# EAGLE schematic testeando_libs (EAGLE 7.2.0)
Pruebas biblioteca "treser_lib".
CDESIGNER: Treser; CNAME: PRUEBAS BIBLIOTECA; CREVISION: 1; CSCHO: EEST N°5
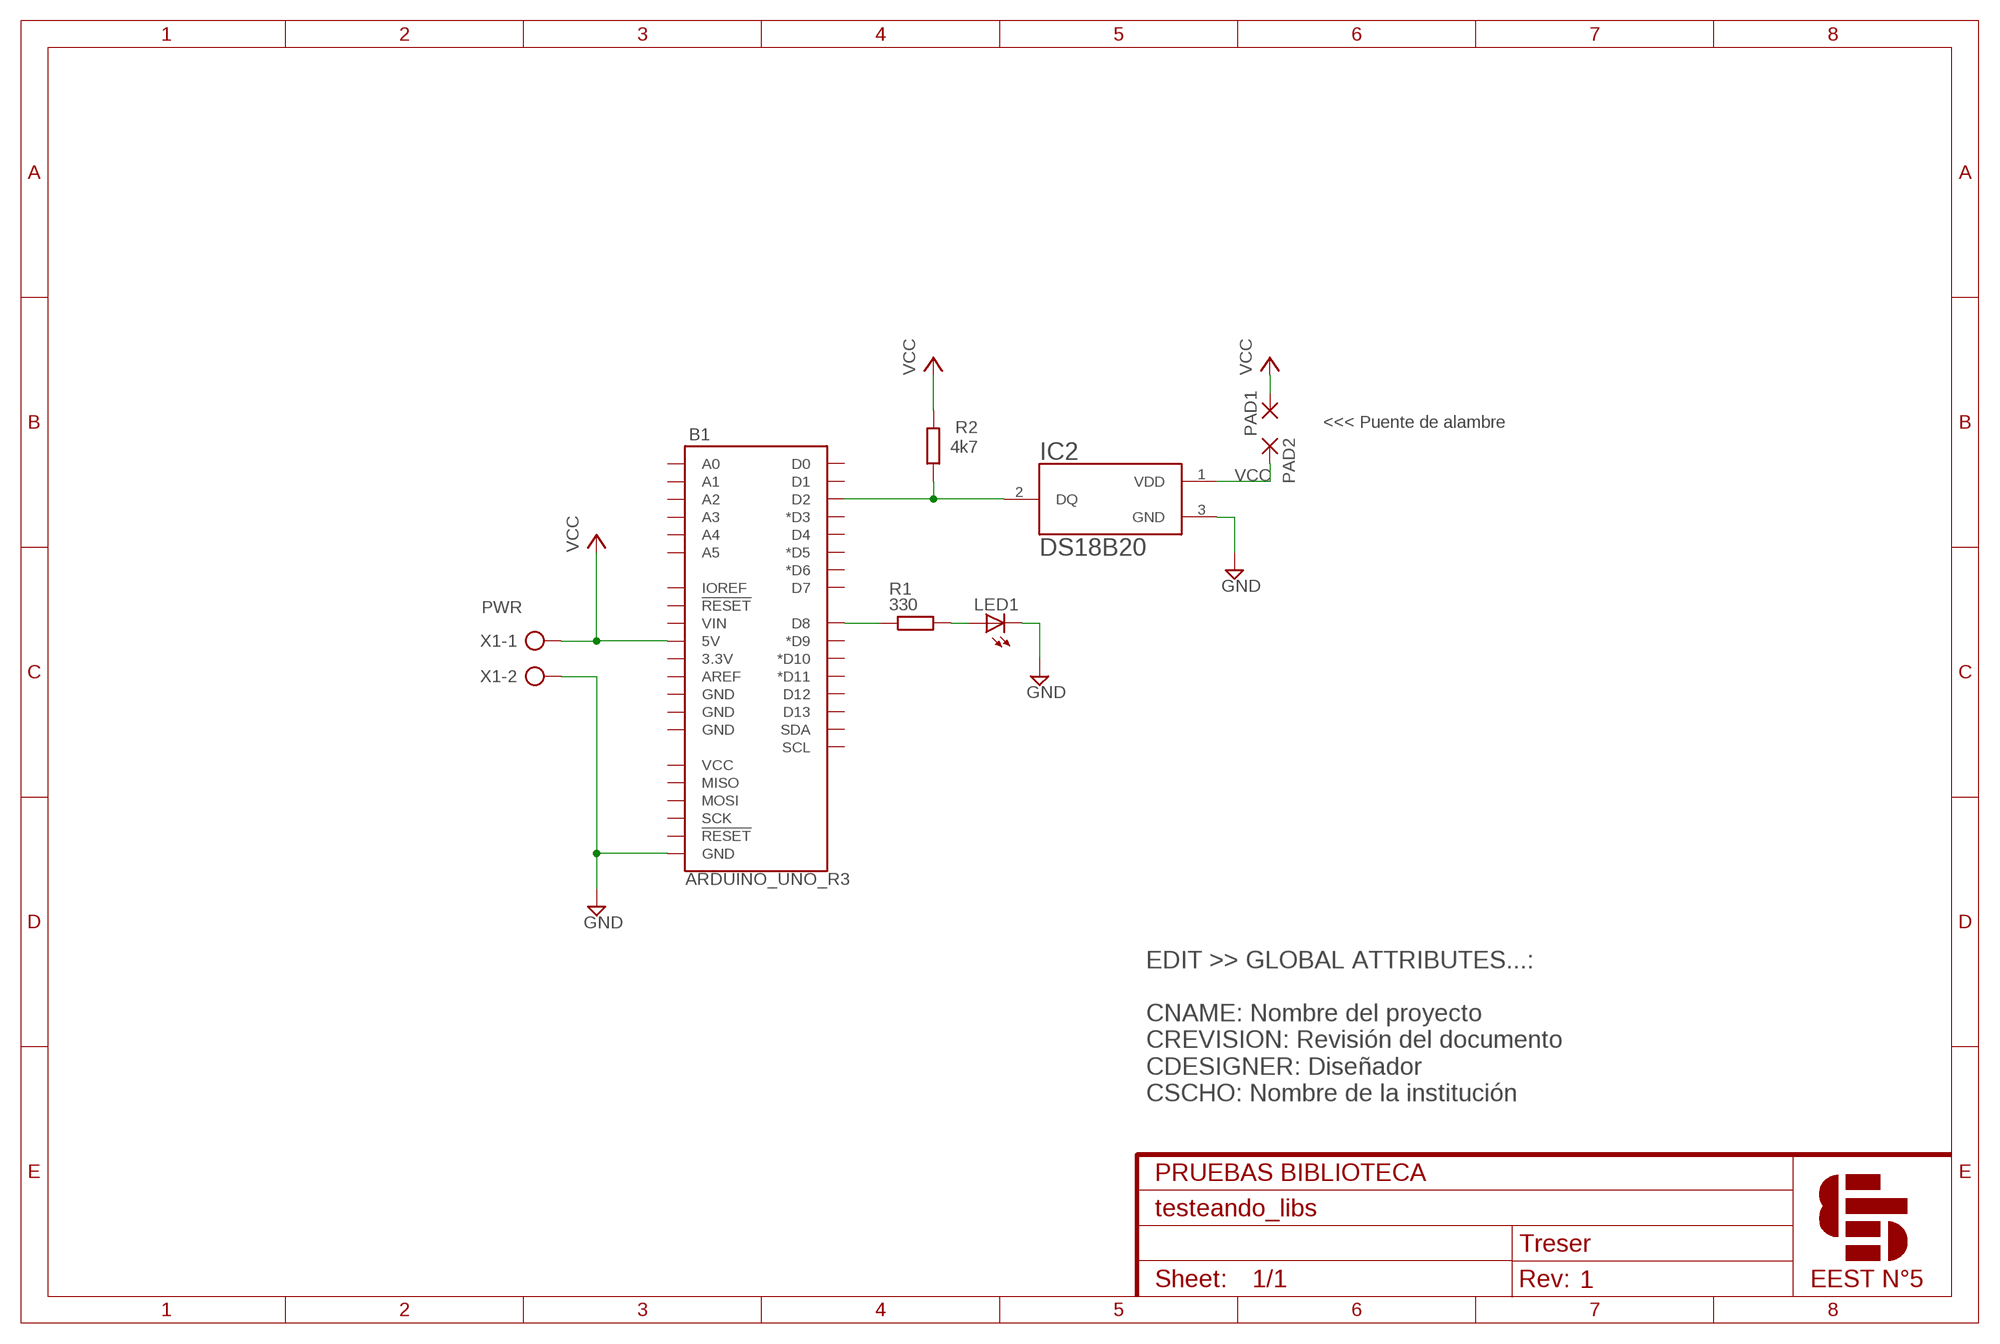
[diagram p0: schematic, sheet 1]

## Parts
B1  ARDUINO_UNO_R3  [ARDUINO_R3]
IC2  DS18B20  [TO92]
LED1  LED5MM  [LED5MM]
PAD1  PAD_1,6/0,8  [1,6/0,8]
PAD2  PAD_1,6/0,8  [1,6/0,8]
R1  330  RESISTOR-EU0204/7  [0204/7]
R2  4k7  RESISTOR-EU0204/7  [0204/7]
U$1  LOGO_EEST_N5  [LOGO_EEST_N5_PAC_250]
X1  PWR  BORNERA_AK500/2  [AK500/2]

## Nets
GND: B1.GND@1(GND) IC2.3(GND) LED1.K(C) X1.2
N$1: B1.D8 R1.1
N$2: LED1.A R1.2
N$3: B1.D2 IC2.2(DQ) R2.1
VCC: B1.5V IC2.1(VDD) PAD1.1(P) PAD2.1(P) R2.2 X1.1
Unconnected: B1.3.3V B1.A0 B1.A1 B1.A2 B1.A3 B1.A4 B1.A5 B1.AREF B1.D0 B1.D1 B1.D3(*D3) B1.D4 B1.D5(*D5) B1.D6(*D6) B1.D7 B1.D9(*D9) B1.D10(*D10) B1.D11(*D11) B1.D12 B1.D13 B1.GND@2(GND) B1.GND@3(GND) B1.GND@4(GND) B1.IOREF B1.MISO B1.MOSI B1.RESET@1(!RESET!) B1.RESET@2(!RESET!) B1.SCK B1.SCL B1.SDA B1.VCC B1.VIN

## Notes on the sheet
- <<< Puente de alambre
- EDIT >> GLOBAL ATTRIBUTES...:
  
  CNAME: Nombre del proyecto
  CREVISION: Revisión del documento
  CDESIGNER: Diseñador
  CSCHO: Nombre de la institución

## Library data of the parts
B1 = treser_lib:ARDUINO_UNO_R3: Arduino Uno R3 Arduino Uno R3 Compatible Footprint with SPI header. Matches PCB size of the original board.
IC2 = treser_lib:DS18B20: DS18B20 Sensor de temperatura. Rango: -55 a 125°C. TO-92, THT.
LED1 = led:LED: LED OSRAM: - CHIPLED LG R971, LG N971, LY N971, LG Q971, LY Q971, LO R971, LY R971 LH N974, LH R974 LS Q976, LO Q976, LY Q976 LO Q996 - Hyper CHIPLED LW Q18S LB Q993, LB Q99A, LB R99A - SideLED LS A670, LO A670, LY A670, LG A670, LP A670 LB A673, LV A673, LT A673, LW A673 LH A674 LY A675 LS A676, LA A676, LO A676, LY A676, LW A676 LS A679, LY A679, LG A679 - Hyper Micro SIDELED® LS Y876, LA Y876, LO Y876, LY Y876 LT Y87S - SmartLED LW L88C, LW L88S LB L89C, LB L89S, LG L890 LS L89K, LO L89K, LY L89K LS L896, LA L896, LO L896, LY L896 - TOPLED LS T670, LO T670, LY T670, LG T670, LP T670 LSG T670, LSP T670, LSY T670, LOP T670, LYG T670 LG T671, LOG T671, LSG T671 LB T673, LV T673, LT T673, LW T673 LH T674 LS T676, LA T676, LO T676, LY T676, LB T676, LH T676, LSB T676, LW T676 LB T67C, LV T67C, LT T67C, LS T67K, LO T67K, LY T67K, LW E67C LS E67B, LA E67B, LO E67B, LY E67B, LB E67C, LV E67C, LT E67C LW T67C LS T679, LY T679, LG T679 LS T770, LO T770, LY T770, LG T770, LP T770 LB T773, LV T773, LT T773, LW T773 LH T774 LS E675, LA E675, LY E675, LS T675 LS T776, LA T776, LO T776, LY T776, LB T776 LHGB T686 LT T68C, LB T68C - Hyper Mini TOPLED® LB M676 - Mini TOPLED Santana® LG M470 LS M47K, LO M47K, LY M47K Source: http://www.osram.convergy.de LUXEON: - LUMILED® LXK2-PW12-R00, LXK2-PW12-S00, LXK2-PW14-U00, LXK2-PW14-V00 LXK2-PM12-R00, LXK2-PM12-S00, LXK2-PM14-U00 LXK2-PE12-Q00, LXK2-PE12-R00, LXK2-PE12-S00, LXK2-PE14-T00, LXK2-PE14-U00 LXK2-PB12-K00, LXK2-PB12-L00, LXK2-PB12-M00, LXK2-PB14-N00, LXK2-PB14-P00, LXK2-PB14-Q00 LXK2-PR12-L00, LXK2-PR12-M00, LXK2-PR14-Q00, LXK2-PR14-R00 LXK2-PD12-Q00, LXK2-PD12-R00, LXK2-PD12-S00 LXK2-PH12-R00, LXK2-PH12-S00 LXK2-PL12-P00, LXK2-PL12-Q00, LXK2-PL12-R00 Source: www.luxeon.com KINGBRIGHT: KA-3528ASYC Source: www.kingbright.com
PAD1 PAD2 = treser_lib:PAD_1,6/0,8: Through-Hole PAD
R1 R2 = treser_lib:RESISTOR-EU: Resistor Simbolo europeo.
U$1 = treser_lib:LOGO_EEST_N5: Logo EEST N° 5 Mar del Plata
X1 = treser_lib:BORNERA_AK500/2: Bornera de tornillo; OC_FARNELL: unknown; OC_NEWARK: unknown